# EAGLE schematic bluebox (EAGLE 8.7.0)
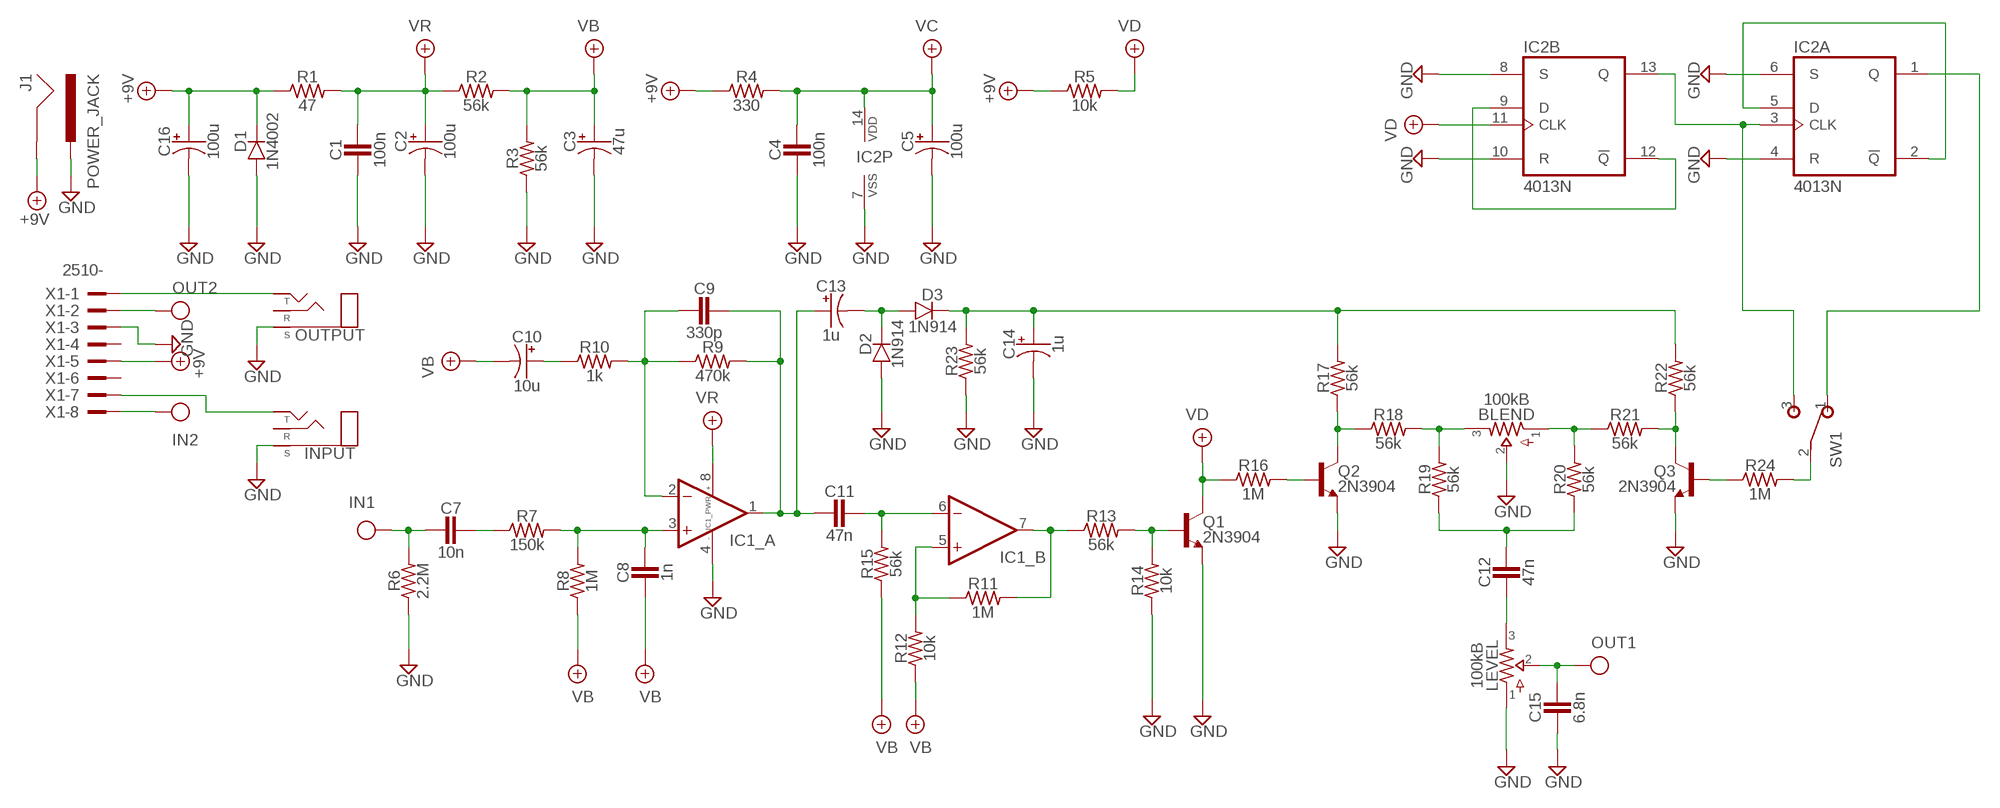
[diagram p0: schematic, sheet 1]

## Parts
BLEND  100kB  POTS16MM  [16MM]
C1  100n  CER/FILM2  [050X030_025_2]
C2  100u  0500  [050_020]
C3  47u  0500  [050_020]
C4  100n  CER/FILM2  [050X030_025_2]
C5  100u  0500  [050_020]
C7  10n  CER/FILMBOX.1  [BOX_SMALL]
C8  1n  CER/FILMBOX.1  [BOX_SMALL]
C9  330p  CER/FILM2  [050X030_025_2]
C10  10u  0500  [050_020]
C11  47n  CER/FILMBOX.1  [BOX_SMALL]
C12  47n  CER/FILMBOX.1  [BOX_SMALL]
C13  1u  0400  [040_020]
C14  1u  0400  [040_020]
C15  6.8n  CER/FILMBOX.1  [BOX_SMALL]
C16  100u  0500  [050_020]
D1  1N4002  DO41.2  [DO41-2]
D2  1N914  DO35.2  [DO35-2]
D3  1N914  DO35.2  [DO35-2]
IC1  DUALTH  [DIL0]
IC2  4013N  [DIL14]
INPUT  STEREONMJ  [NMJ6HCD2]
J1  POWER_JACK  [POWER_JACK_PTH]
LEVEL  100kB  POTS16MM  [16MM]
OUTPUT  STEREONMJ  [NMJ6HCD2]
Q1  2N3904  [TO92-]
Q2  2N3904  [TO92-]
Q3  2N3904  [TO92-]
R1  47  R_.3B  [R0207/3]
R2  56k  R_.3B  [R0207/3]
R3  56k  R_.3B  [R0207/3]
R4  330  R_.3B  [R0207/3]
R5  10k  R_.3B  [R0207/3]
R6  2.2M  R_.3B  [R0207/3]
R7  150k  R_.3B  [R0207/3]
R8  1M  R_.3B  [R0207/3]
R9  470k  R_.3B  [R0207/3]
R10  1k  R_.3B  [R0207/3]
R11  1M  R_.3B  [R0207/3]
R12  10k  R_.3B  [R0207/3]
R13  56k  R_.3B  [R0207/3]
R14  10k  R_.3B  [R0207/3]
R15  56k  R_.3B  [R0207/3]
R16  1M  R_.3B  [R0207/3]
R17  56k  R_.3B  [R0207/3]
R18  56k  R_.3B  [R0207/3]
R19  56k  R_.3B  [R0207/3]
R20  56k  R_.3B  [R0207/3]
R21  56k  R_.3B  [R0207/3]
R22  56k  R_.3B  [R0207/3]
R23  56k  R_.3B  [R0207/3]
R24  1M  R_.3B  [R0207/3]
SW1  SPDTPIN_MOUNT  [1MS1T1B1C0M2QE]
X1  2510-  [PAK100/2500-10]

## Nets
+9V: C16.+ D1.C J1.GND R1.1 R4.1 R5.1 X1.5
GND: BLEND.2 C1.2 C2.- C3.- C4.2 C5.- C14.- C15.2 C16.- D1.A D2.A IC1.4(_PWR:V-) IC2.4(A:R) IC2.6(A:S) IC2.7(P:VSS) IC2.8(B:S) IC2.10(B:R) INPUT.S J1.PWR LEVEL.1 OUTPUT.S Q1.3(E) Q2.3(E) Q3.3(E) R3.1 R6.1 R14.1 R23.1 X1.3
IN: C7.2 R6.2 X1.8
N$1: Q3.1(C) R21.2 R22.1
N$2: INPUT.T X1.7
N$3: C7.1 R7.1
N$4: OUTPUT.T X1.1
N$5: C8.1 IC1.3(_A:+IN) R7.2 R8.2
N$6: C9.2 IC1.2(_A:-IN) R9.1 R10.2
N$7: C9.1 C11.2 C13.+ IC1.1(_A:OUT) R9.2
N$8: C10.+ R10.1
N$9: C11.1 IC1.6(_B:-IN) R15.2
N$10: IC1.5(_B:+IN) R11.1 R12.2
N$11: IC1.7(_B:OUT) R11.2 R13.1
N$12: Q1.2(B) R13.2 R14.2
N$13: Q2.2(B) R16.2
N$14: Q2.1(C) R17.1 R18.1
N$15: BLEND.3 R18.2 R19.2
N$16: BLEND.1 R20.2 R21.1
N$17: C12.1 R19.1 R20.1
N$18: C14.+ D3.C R17.2 R22.2 R23.2
N$19: Q3.2(B) R24.1
N$20: C13.- D2.C D3.A
N$21: C12.2 LEVEL.3
N$22: IC2.3(A:CLK) IC2.13(B:Q) SW1.3(S)
N$23: IC2.9(B:D) IC2.12(B:!Q)
N$24: IC2.1(A:Q) SW1.1(O)
N$25: IC2.2(A:!Q) IC2.5(A:D)
N$27: R24.2 SW1.2(P)
OUT: C15.1 LEVEL.2 X1.2
VB: C3.+ C8.2 C10.- R2.2 R3.2 R8.1 R12.1 R15.1
VC: C4.1 C5.+ IC2.14(P:VDD) R4.2
VD: IC2.11(B:CLK) Q1.1(C) R5.2 R16.1
VR: C1.1 C2.+ IC1.8(_PWR:V+) R1.2 R2.1
Unconnected: INPUT.R OUTPUT.R X1.4 X1.6

## Library data of the parts
BLEND LEVEL = pedals-potentiometers:POTS
C1 C4 C7-C9 C11 C12 C15 = pedals-capacitors-film:CER/FILM: 47 - 120pF Xicon Ceramic Disc 2.5mm lead spacing
C2 C3 C5 C10 C16 = pedals-capacitors-elec:050
C13 C14 = pedals-capacitors-elec:040
D1 = pedals-diodes:DO41: DO-41 Package Diodes: 1N4001 - 1N40019 Zener Diodes: 1N4728 - 1N4764
D2 D3 = pedals-diodes:DO35: DO-35 Package Diodes: 1N914
IC1 = pedals-integrated circuits:DUAL: OP AMP
IC2 = pedals-integrated circuits:4013: Dual D FLIP FLOP, set/reset
INPUT OUTPUT = pedals-jacks:STEREO
J1 = pedals-jacks:POWER_JACK: Power Jack Connector This is the standard 5.5mm barrel jack for power. The PTH is the most common, proven, reliable, footprint. The Slot footprint only works if the mill layer is transmitted to the PCB fab house so be warned. Here are the connectors we sell at SparkFun: DC Barrel Power Jack/Connector <https://www.sparkfun.com/products/119> (PRT-00119) DC Barrel Power Jack/Connector (SMD) <https://www.sparkfun.com/products/12748> (PRT-12748) DC Barrel Jack Adapter - Breadboard Compatible <https://www.sparkfun.com/products/10811> (PRT-10811) It is used on this SparkFun product (and many, many others): SparkFun RedBoard - Programmed with Arduino <https://www.sparkfun.com/products/12757> (DEV-12757) Also, if you need a mating power supply or connector, please check these out: Wall Adapter Power Supply - 9VDC 650mA <https://www.sparkfun.com/products/298> (TOL-00298) DC Barrel Jack Adapter - Male <https://www.sparkfun.com/products/10287> (PRT-10287); PROD_ID: CONN-08197
Q1-Q3 = pedals-transistors:2N3904: NPN Transistor
R1-R24 = pedals-resistors:R_
SW1 = pedals-switches:SPDT: TOGGLE SWITCH Marquardt
X1 = pedals-headers:2510-: 3M (TM) Pak 100 4-Wall Header Source: 3M; MF: 3M; MPN: 2510-6002UB; OC_FARNELL: 9838244; OC_NEWARK: 46F4725